# EAGLE design rfm70 (EAGLE 7.3.0)
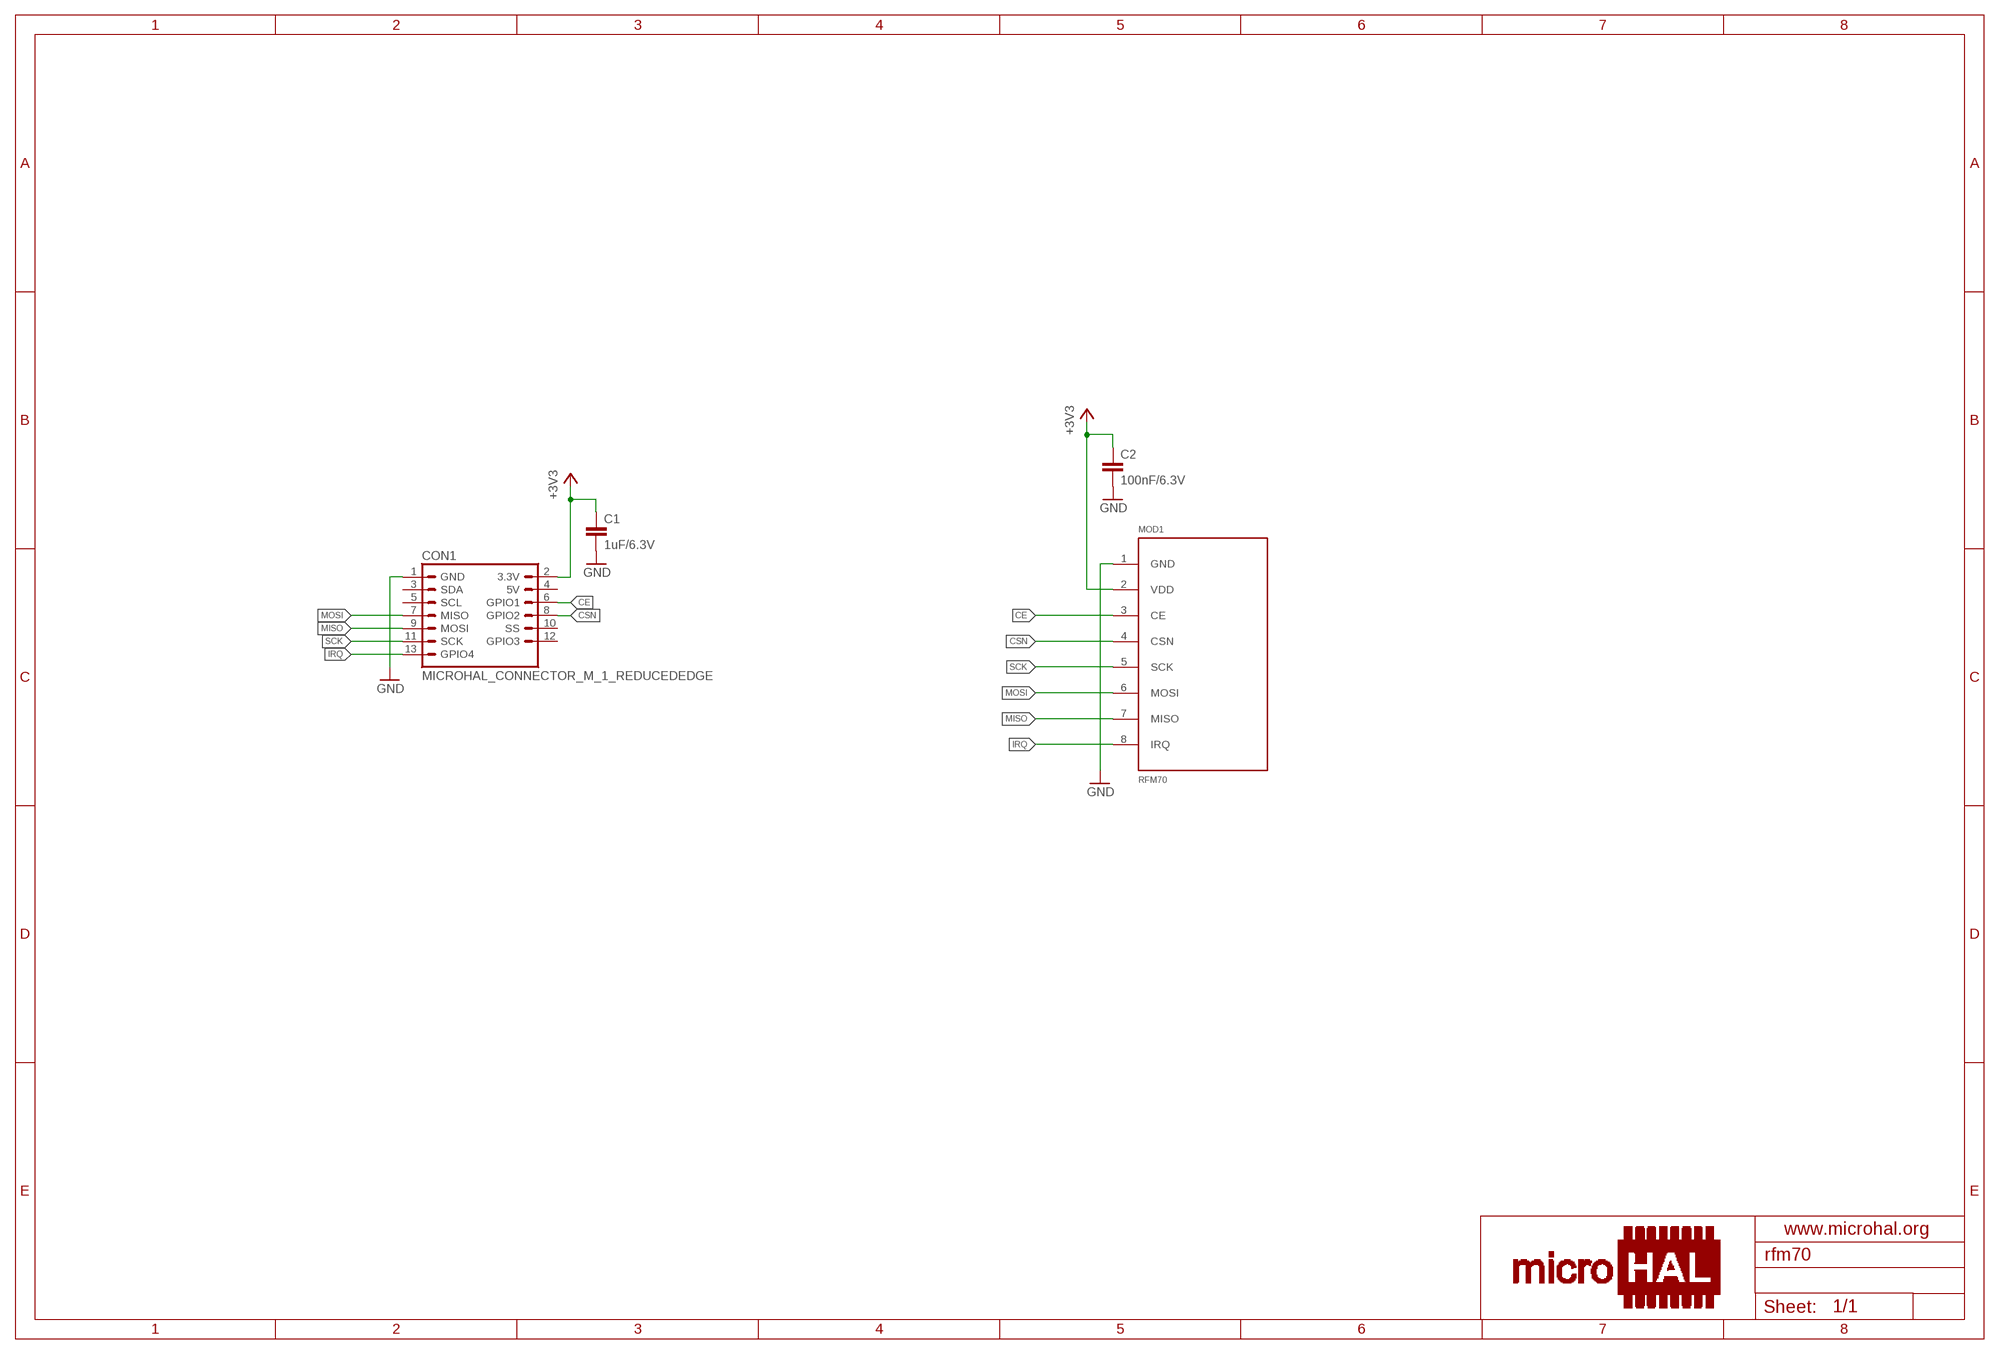
[diagram p0: schematic, sheet 1]

## Parts
C1  1uF/6.3V  C-EUC0603K  [C0603K]
C2  100nF/6.3V  C-EUC0603K  [C0603K]
CON1  MICROHAL_CONNECTOR_M_1_REDUCEDEDGE  [MICROHAL_CONNECTOR_M_1_REDUCED_EDGE]
MOD1  RFM70  [RFM70_PACK]

## Nets
+3V3: C1.1 C2.1 CON1.2(3.3V) MOD1.2(VDD)
CE: CON1.6(GPIO1) MOD1.3(CE)
CSN: CON1.8(GPIO2) MOD1.4(CSN)
GND: C1.2 C2.2 CON1.1(GND) MOD1.1(GND)
IRQ: CON1.13(GPIO4) MOD1.8(IRQ)
MISO: CON1.9(MOSI) MOD1.7(MISO)
MOSI: CON1.7(MISO) MOD1.6(MOSI)
SCK: CON1.11(SCK) MOD1.5(SCK)
Unconnected: CON1.3(SDA) CON1.4(5V) CON1.5(SCL) CON1.10(SS) CON1.12(GPIO3)

## Library data of the parts
C1 C2 = rcl:C-EU: CAPACITOR, European symbol
CON1 = microhal-connector_v0.1:MICROHAL_CONNECTOR_M_1_REDUCED
MOD1 = rfm70:RFM70

## Board
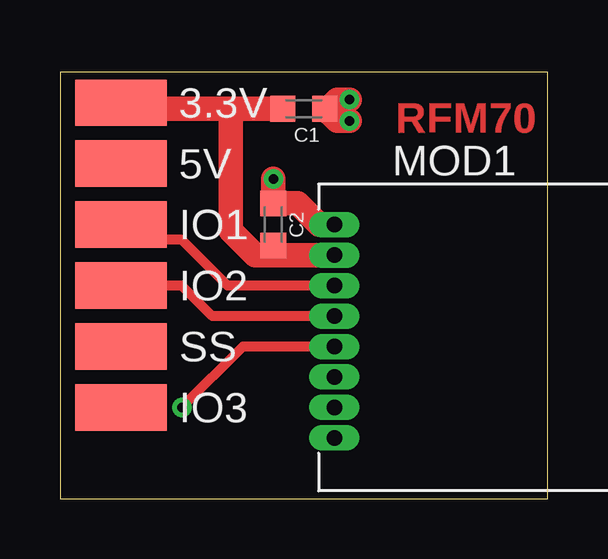
[diagram p1: board, top side]
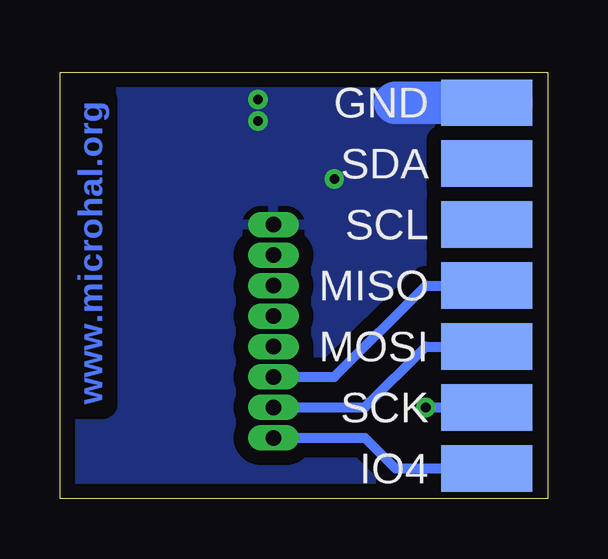
[diagram p2: board, bottom side, seen from below]

Size 20.32 x 17.78 mm. Coordinates in mm from the lower left corner, seen from the top.
Outline: 0,0 20.32,0 20.32,17.78 0,17.78 0,0
Copper layers (1*16): Top 0.035mm / dielectric 1.5mm / Bottom 0.035mm
Design rules "default *": minimum track width 10mil, minimum drill 24mil, track to track 8mil, track to pad 8mil, pad to pad 8mil, via to via 8mil, smd to smd 4mil, copper to edge 20mil, drill to drill 8mil, minimum pad ring 8mil, minimum via ring 8mil, stop-mask expansion 4mil, vias tented up to drill 16mil, thermal gap 10mil

### Footprints (pad centres in the part's own frame; a part is rotated, then mirrored left to right if it is on the bottom)
C0603K = smd 1.05 x 1.08: 1 -0.875,0; 2 0.875,0
MICROHAL_CONNECTOR_M_1_REDUCED_EDGE = smd 1.93 x 3.81 bottom: 1 -7.62,0; 3 -5.08,0; 5 -2.54,0; 7 0,0; 9 2.54,0; 11 5.08,0; 13 7.62,0 | smd 1.93 x 3.81: 2 -7.62,0; 4 -5.08,0; 6 -2.54,0; 8 0,0; 10 2.54,0; 12 5.08,0
RFM70_PACK = drill 0.65 pad 1.016 long: 1 -5.08,-7.62; 2 -3.81,-7.62; 3 -2.54,-7.62; 4 -1.27,-7.62; 5 0,-7.62; 6 1.27,-7.62; 7 2.54,-7.62; 8 3.81,-7.62

### Placement (x,y rotation side)
C1  10.16,16.26 0 top
C2  8.89,11.43 90 top
CON1  2.54,8.89 270 top
MOD1  19.05,6.35 270 top

### Tracks (layer width: path | path; a pad name or v marks a point on that pad's centre or on a via)
+3V3
  Top 1.016: CON1.2 2.79,16.26 6.86,16.26 | 6.86,16.26 C1.1 | MOD1.2 8.89,10.16 | 8.89,10.16 8.13,10.16 7.11,11.18 7.11,16 6.86,16.26 | C2.1 8.89,10.16
CE
  Top 0.406: MOD1.3 6.99,8.89 5.08,10.79 3.17,10.79 CON1.6
CSN
  Top 0.406: MOD1.4 6.35,7.62 5.08,8.89 CON1.8
GND  (via drill 0.4)
  Top 1.016: v12.06,15.75 11.54,15.75 C1.2 | v12.06,16.64 11.56,16.64 11.18,16.26 | MOD1.1 10.79,11.43 9.91,12.32 8.9,12.32 C2.2 | v8.89,13.34 8.89,12.7
  Bottom 1.778: CON1.1 6.35,16.51
  pour Bottom (isolate 0.61): 0,0 0,17.78 20.32,17.78 20.32,0
IRQ
  Bottom 0.406: MOD1.8 7.62,2.54 6.35,1.27 CON1.13
MISO
  Bottom 0.406: MOD1.7 7.62,3.81 5.08,6.35 CON1.9
MOSI
  Bottom 0.406: MOD1.6 8.89,5.08 5.08,8.89 CON1.7
SCK  (via drill 0.4)
  Top 0.406: MOD1.5 7.62,6.35 v5.08,3.81
  Bottom 0.406: v5.08,3.81 CON1.11

### Text on the board
Top: RFM70
Bottom: www.microhal.org
tStop: RFM70
bStop: www.microhal.org